# EAGLE design msp430 (EAGLE 7.1.0)
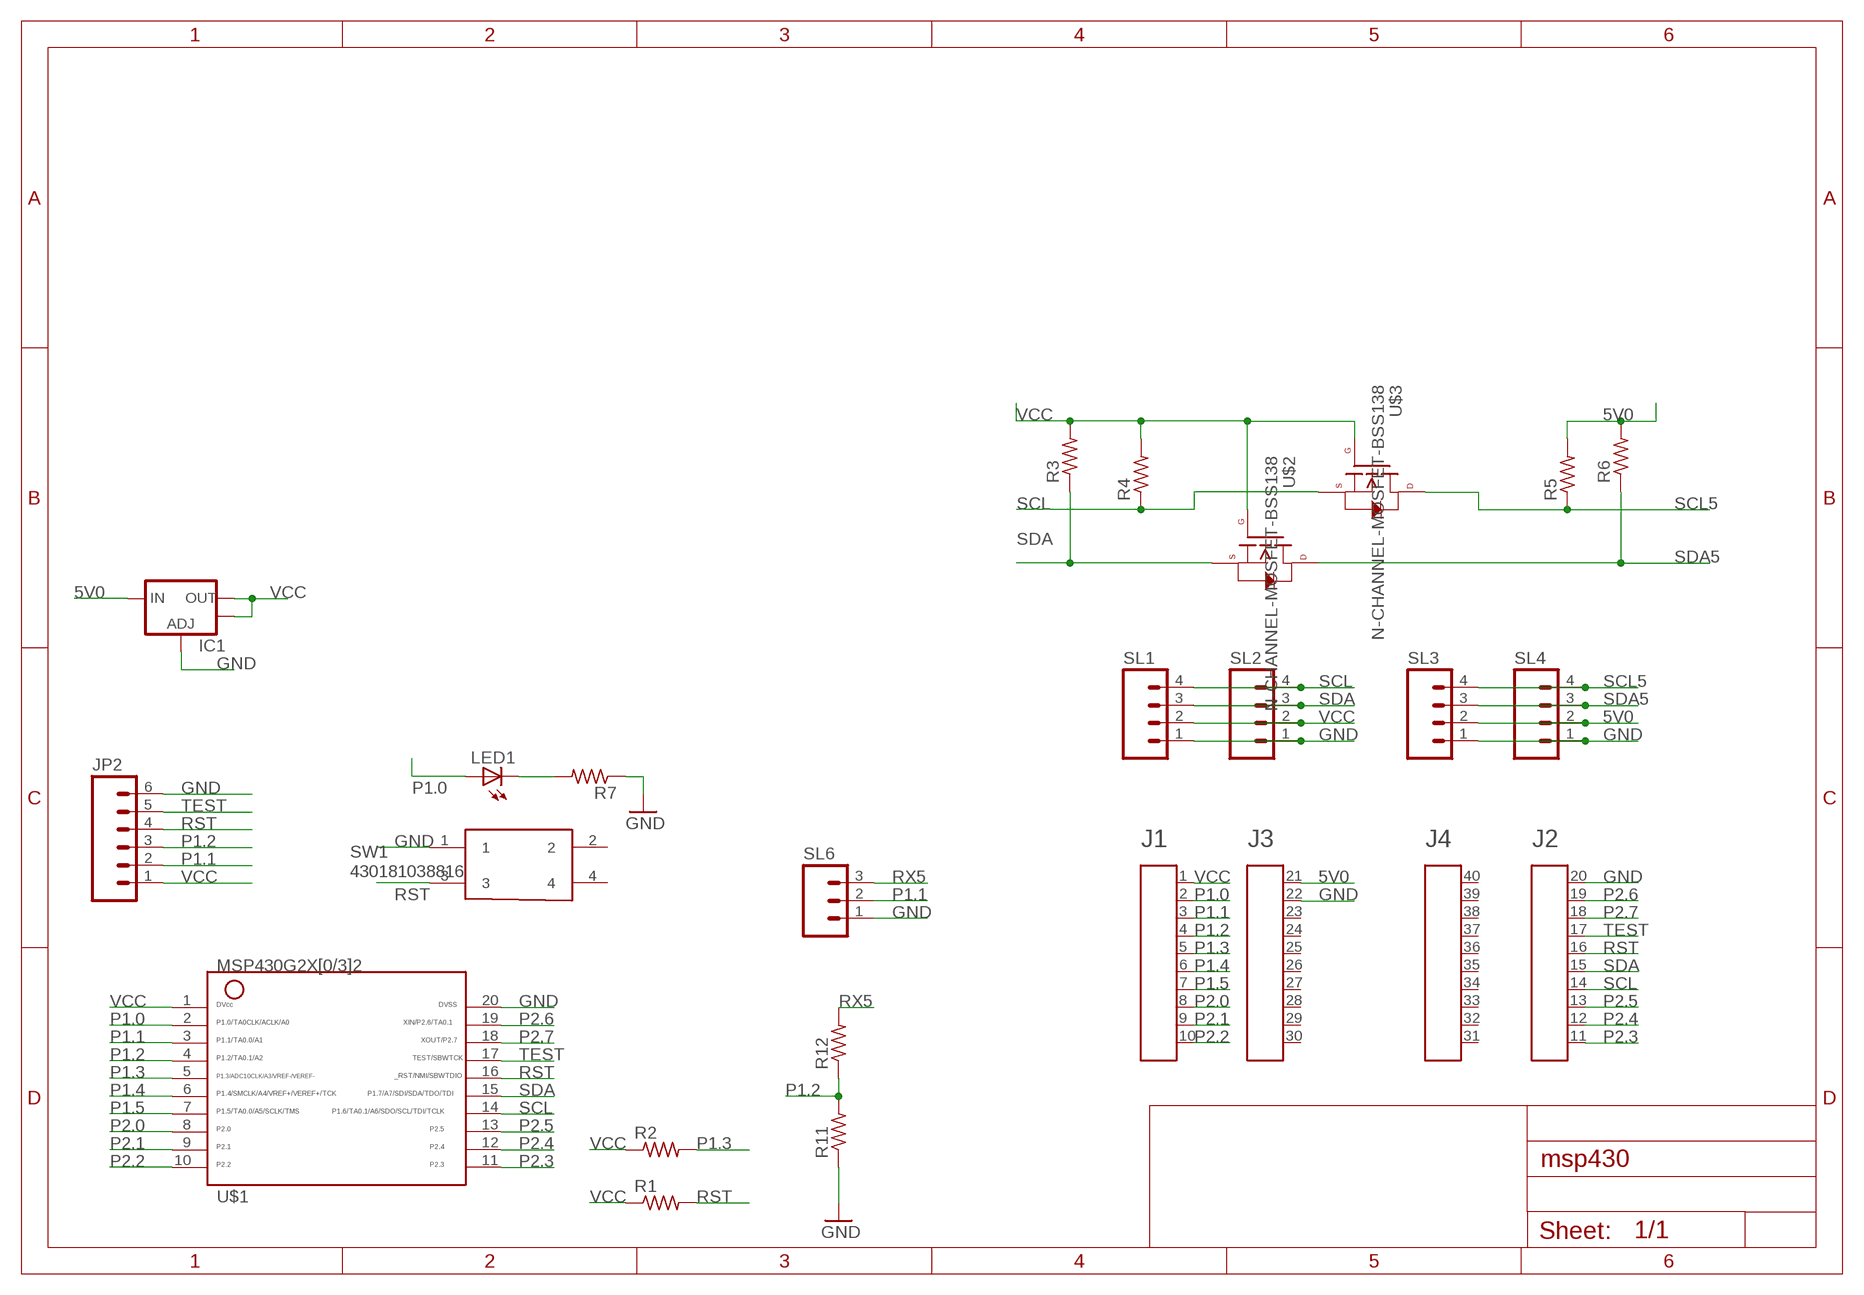
[diagram p0: schematic, sheet 1]

## Parts
A1  HEADER4X10-BOOSTERPACK  [4X10-BOOSTERPACK]
IC1  V_REG_LM1117SOT223  [SOT223]
JP2  M06LOCK  [1X06_LOCK]
LED1  LEDCHIPLED_0805  [CHIPLED_0805]
R1  R-US_M0805  [M0805]
R2  R-US_M0805  [M0805]
R3  R-US_M0805  [M0805]
R4  R-US_M0805  [M0805]
R5  R-US_M0805  [M0805]
R6  R-US_M0805  [M0805]
R7  R-US_M0805  [M0805]
R11  R-US_M0805  [M0805]
R12  R-US_M0805  [M0805]
SL1  M04  [04P]
SL2  M04  [04P]
SL3  M04  [04P]
SL4  M04  [04P]
SL6  M03  [03P]
SW1  430181038816  [430181038816]
U$1  G2X[0/3]2---N20  [N20]
U$2  N-CHANNEL-MOSFET-BSS138  [SOT23-3]
U$3  N-CHANNEL-MOSFET-BSS138  [SOT23-3]

## Nets
5V0: A1.21 IC1.3(IN) R5.2 R6.2 SL3.2 SL4.2
GND: A1.20 A1.22 IC1.1(ADJ) JP2.6 R7.1 R11.1 SL1.1 SL2.1 SL3.1 SL4.1 SL6.1 SW1.1 U$1.20
N$1: LED1.C R7.2
P1.0: A1.2 LED1.A U$1.2
P1.1: A1.3 JP2.2 SL6.2 U$1.3
P1.2: A1.4 JP2.3 R11.2 R12.1 U$1.4
P1.3: A1.5 R2.2 U$1.5
P1.4: A1.6 U$1.6
P1.5: A1.7 U$1.7
P2.0: A1.8 U$1.8
P2.1: A1.9 U$1.9
P2.2: A1.10 U$1.10
P2.3: A1.11 U$1.11
P2.4: A1.12 U$1.12
P2.5: A1.13 U$1.13
P2.6: A1.19 U$1.19
P2.7: A1.18 U$1.18
RST: A1.16 JP2.4 R1.2 SW1.3 U$1.16
RX5: R12.2 SL6.3
SCL: A1.14 R4.1 SL1.4 SL2.4 U$1.14 U$3.2(S)
SCL5: R5.1 SL3.4 SL4.4 U$3.3(D)
SDA: A1.15 R3.1 SL1.3 SL2.3 U$1.15 U$2.2(S)
SDA5: R6.1 SL3.3 SL4.3 U$2.3(D)
TEST: A1.17 JP2.5 U$1.17
VCC: A1.1 IC1.2(OUT) IC1.4(OUT) JP2.1 R1.1 R2.1 R3.2 R4.2 SL1.2 SL2.2 U$1.1 U$2.1(G) U$3.1(G)
Unconnected: A1.23 A1.24 A1.25 A1.26 A1.27 A1.28 A1.29 A1.30 A1.31 A1.32 A1.33 A1.34 A1.35 A1.36 A1.37 A1.38 A1.39 A1.40 SW1.2 SW1.4

## Library data of the parts
A1 = EAGLE_BoosterPack_Library:HEADER4X10-BOOSTERPACK
IC1 = tpdl-regulators:V_REG_LM1117: Voltage Regulator LM1117 Standard adjustable voltage regulator but in SMD form. Spark Fun Electronics SKU : COM-00595
JP2 = thoughtprocess:M06: Header 6 Standard 6-pin 0.1" header. Use with straight break away headers (SKU : PRT-00116), right angle break away headers (PRT-00553), swiss pins (PRT-00743), machine pins (PRT-00117), and female headers (PRT-00115). Molex polarized connector foot print use with SKU : PRT-08094 with associated crimp pins and housings. NOTES ON THE VARIANTS LOCK and LOCK_LONGPADS... This footprint was designed to help hold the alignment of a through-hole component (i.e. 6-pin header) while soldering it into place. You may notice that each hole has been shifted either up or down by 0.005 of an inch from it's more standard position (which is a perfectly straight line). This slight alteration caused the pins (the squares in the middle) to touch the edges of the holes. Because they are alternating, it causes a "brace" to hold the component in place. 0.005 has proven to be the perfect amount of "off-center" position when using our standard breakaway headers. Although looks a little odd when you look at the bare footprint, once you have a header in there, the alteration is very hard to notice. Also,if you push a header all the way into place, it is covered up entirely on the bottom side. This idea of altering the position of holes to aid alignment will be further integrated into the Sparkfun Library for other footprints. It can help hold any component with 3 or more connection pins.
LED1 = adafruit:LED: LED OSRAM: - CHIPLED LG R971, LG N971, LY N971, LG Q971, LY Q971, LO R971, LY R971 LH N974, LH R974 LS Q976, LO Q976, LY Q976 LO Q996 - Hyper CHIPLED LW Q18S LB Q993, LB Q99A, LB R99A - SideLED LS A670, LO A670, LY A670, LG A670, LP A670 LB A673, LV A673, LT A673, LW A673 LH A674 LY A675 LS A676, LA A676, LO A676, LY A676, LW A676 LS A679, LY A679, LG A679 - Hyper Micro SIDELED® LS Y876, LA Y876, LO Y876, LY Y876 LT Y87S - SmartLED LW L88C, LW L88S LB L89C, LB L89S, LG L890 LS L89K, LO L89K, LY L89K LS L896, LA L896, LO L896, LY L896 - TOPLED LS T670, LO T670, LY T670, LG T670, LP T670 LSG T670, LSP T670, LSY T670, LOP T670, LYG T670 LG T671, LOG T671, LSG T671 LB T673, LV T673, LT T673, LW T673 LH T674 LS T676, LA T676, LO T676, LY T676, LB T676, LH T676, LSB T676, LW T676 LB T67C, LV T67C, LT T67C, LS T67K, LO T67K, LY T67K, LW E67C LS E67B, LA E67B, LO E67B, LY E67B, LB E67C, LV E67C, LT E67C LW T67C LS T679, LY T679, LG T679 LS T770, LO T770, LY T770, LG T770, LP T770 LB T773, LV T773, LT T773, LW T773 LH T774 LS E675, LA E675, LY E675, LS T675 LS T776, LA T776, LO T776, LY T776, LB T776 LHGB T686 LT T68C, LB T68C - Hyper Mini TOPLED® LB M676 - Mini TOPLED Santana® LG M470 LS M47K, LO M47K, LY M47K Source: http://www.osram.convergy.de/
R1-R7 R11 R12 = tpdl-passives:R-US_: RESISTOR, American symbol
SL1-SL4 = con-amp-quick:M04: AMP QUICK CONNECTOR; OC_FARNELL: unknown; OC_NEWARK: unknown
SL6 = con-amp-quick:M03: AMP QUICK CONNECTOR; OC_FARNELL: unknown; OC_NEWARK: unknown
SW1 = tpdl-switches:430181038816: WS-TSS-4.5x4.5 mm SMD Tact Switch,4 pins
U$1 = TI_MSP430_v16:G2X[0/3]2---N20: MSP430G2X[0/3]2 MSP430G2x32, MSP430G2x02 PDIP (N) 20 Pin Package http://focus.ti.com/docs/prod/folders/print/msp430g2432.html
U$2 U$3 = tpdl-actives:N-CHANNEL-MOSFET: N-Channel MOSFET Mode Field Effect Transistor; DATASHEET: http://www.fairchildsemi.com/ds/BS/BSS138.pdf; DIGIKEY: BSS138TR-ND; ELEMENT14: 2323154; URL: http://au.element14.com/fairchild-semiconductor/bss138/mosfet-n-ch-50v-220ma-sot-23/dp/2323154

## Board
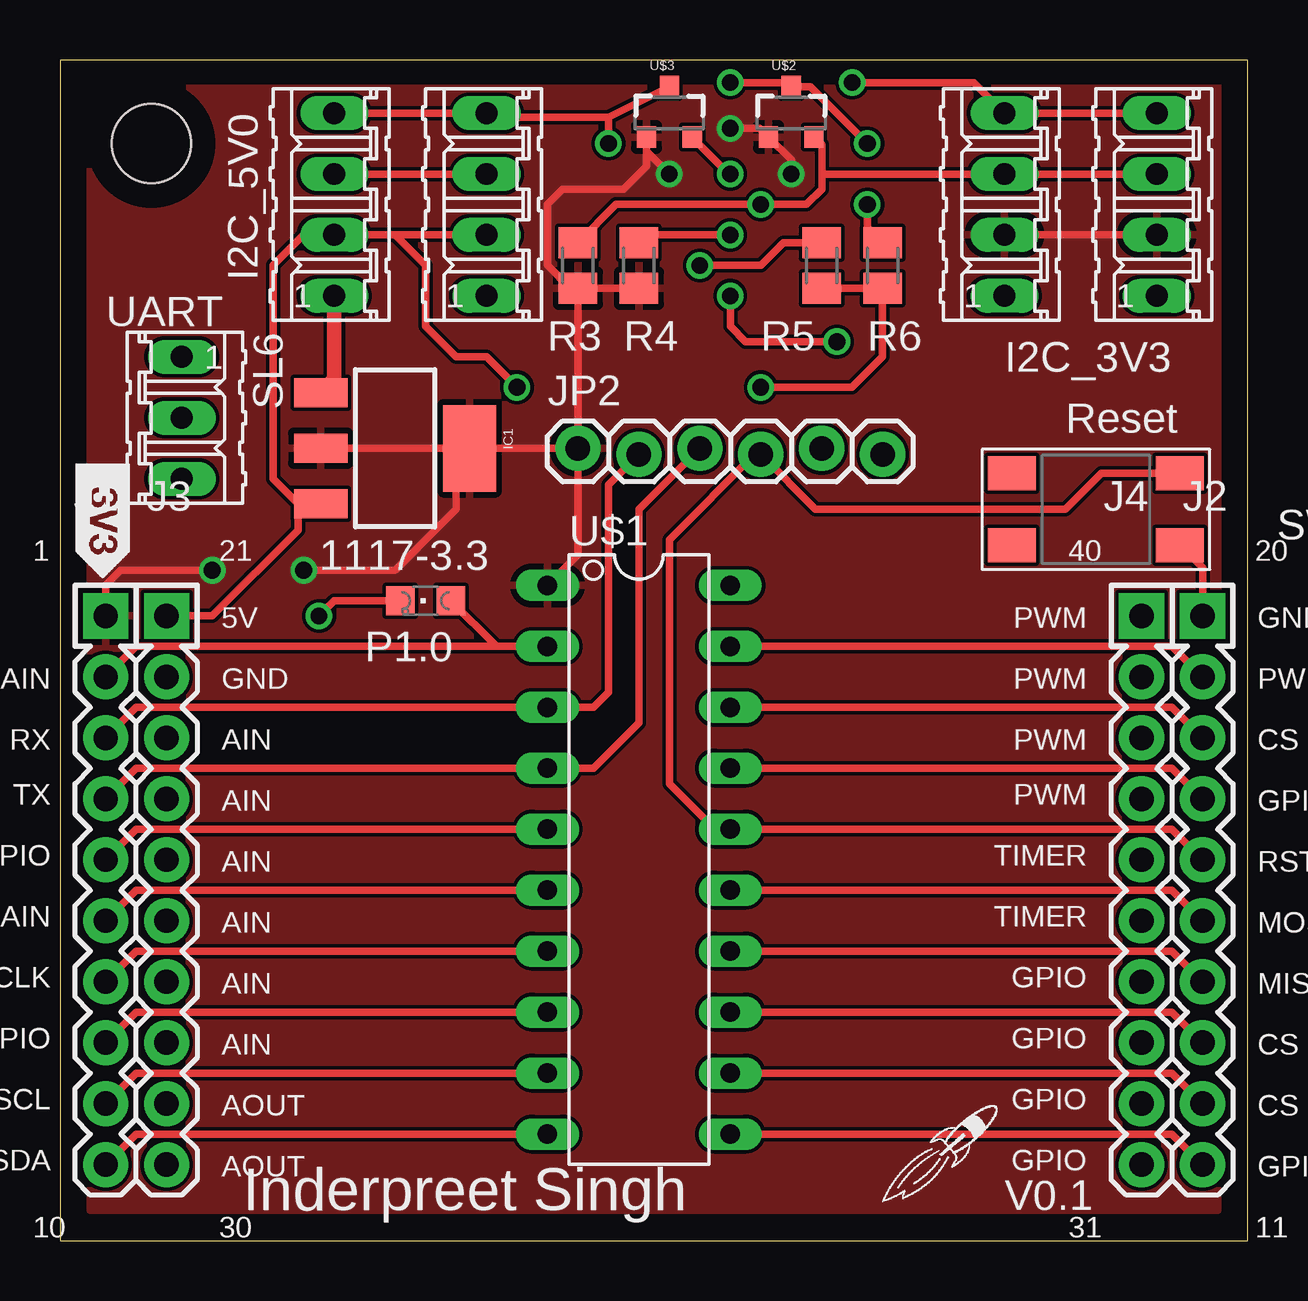
[diagram p1: board, top side]
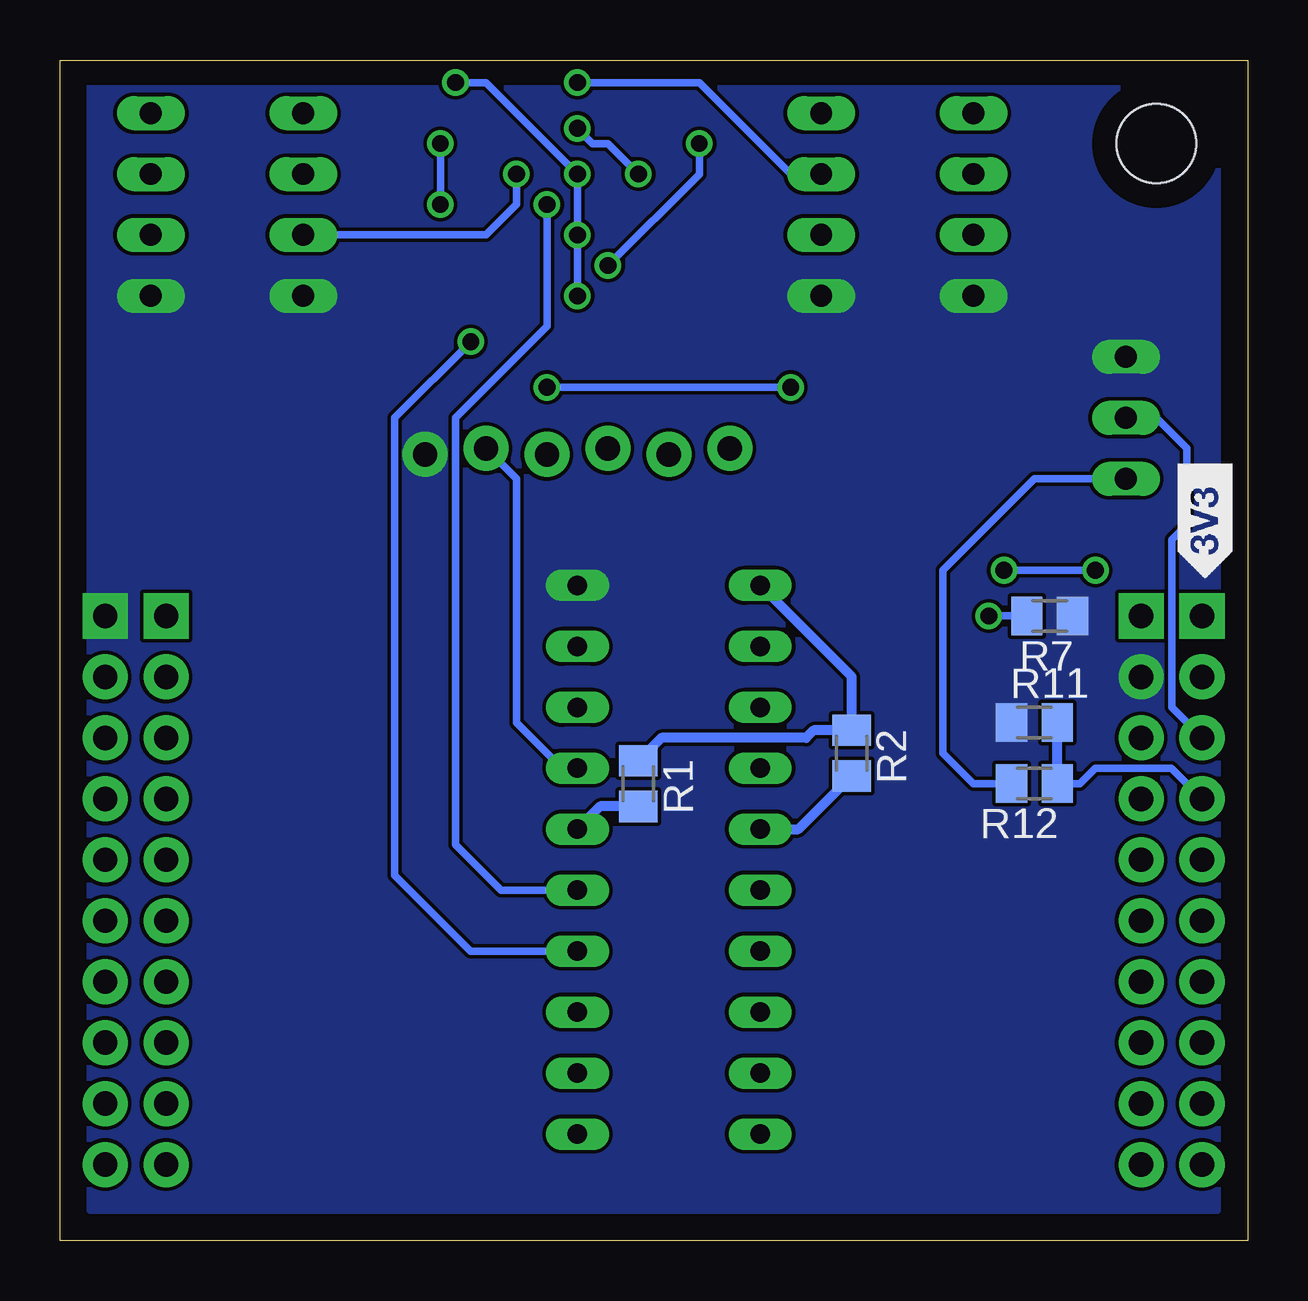
[diagram p2: board, bottom side, seen from below]

Size 49.51 x 49.2 mm. Coordinates in mm from the lower left corner, seen from the top.
Outline: 0,0 49.51,0 49.51,49.2 0,49.2 0,0
Copper layers (1*16): Top 0.035mm / dielectric 1.5mm / Bottom 0.035mm
Design rules "default *": minimum track width 10mil, minimum drill 24mil, track to track 6mil, track to pad 6mil, pad to pad 6mil, via to via 6mil, smd to smd 6mil, copper to edge 40mil, drill to drill 8mil, minimum pad ring 10mil, minimum via ring 8mil, stop-mask expansion 4mil, vias tented up to drill 0mil, thermal gap 10mil

### Footprints (pad centres in the part's own frame; a part is rotated, then mirrored left to right if it is on the bottom)
4X10-BOOSTERPACK = drill 1.016 pad 1.88 square: 1 0,10.16; 20 45.72,10.16; 21 2.54,10.16; 40 43.18,10.16 | drill 1.016 pad 1.88: 2 0,7.62; 3 0,5.08; 4 0,2.54; 5 0,0; 6 0,-2.54; 7 0,-5.08; 8 0,-7.62; 9 0,-10.16; 10 0,-12.7; 11 45.72,-12.7; 12 45.72,-10.16; 13 45.72,-7.62; 14 45.72,-5.08; 15 45.72,-2.54; 16 45.72,0; 17 45.72,2.54; 18 45.72,5.08; 19 45.72,7.62; 22 2.54,7.62; 23 2.54,5.08; 24 2.54,2.54; 25 2.54,0; 26 2.54,-2.54; 27 2.54,-5.08; 28 2.54,-7.62; 29 2.54,-10.16; 30 2.54,-12.7; 31 43.18,-12.7; 32 43.18,-10.16; 33 43.18,-7.62; 34 43.18,-5.08; 35 43.18,-2.54; 36 43.18,0; 37 43.18,2.54; 38 43.18,5.08; 39 43.18,7.62
SOT223 = smd 1.219 x 2.235: 1 -2.311,-3.099; 2 0,-3.099; 3 2.311,-3.099 | smd 3.6 x 2.2: 4 0,3.099
1X06_LOCK = drill 1.016 pad 1.88: 1 0,0; 2 2.54,-0.254; 3 5.08,0; 4 7.62,-0.254; 5 10.16,0; 6 12.7,-0.254
CHIPLED_0805 = smd 1.2 x 1.2: A 0,-1.05; C 0,1.05
M0805 = smd 1.3 x 1.6: 1 -0.95,0; 2 0.95,0
04P = drill 0.914 long: 1 -3.81,0; 2 -1.27,0; 3 1.27,0; 4 3.81,0
03P = drill 0.914 long: 1 -2.54,0; 2 0,0; 3 2.54,0
430181038816 = smd 2 x 1.4: 1 -3.5,1.5; 2 3.5,1.5; 3 -3.5,-1.5; 4 3.5,-1.5
N20 = drill 0.813 long: 1 -11.435,-3.81; 2 -8.895,-3.81; 3 -6.355,-3.81; 4 -3.815,-3.81; 5 -1.275,-3.81; 6 1.265,-3.81; 7 3.805,-3.81; 8 6.345,-3.81; 9 8.885,-3.81; 10 11.425,-3.81; 11 11.425,3.81; 12 8.885,3.81; 13 6.345,3.81; 14 3.805,3.81; 15 1.265,3.81; 16 -1.275,3.81; 17 -3.815,3.81; 18 -6.355,3.81; 19 -8.895,3.81; 20 -11.435,3.81
SOT23-3 = smd 0.8 x 0.9: 1 -0.95,-1; 2 0.95,-1; 3 0,1.1
STAND-OFF = hole 3.302: 0,0

### Placement (x,y rotation side)
A1  1.91,15.88 0 top
IC1  13.97,33.02 270 top
JP2  21.59,33.02 0 top
LED1  15.24,26.67 90 top
R1  25.4,19.05 270 bottom
R2  16.51,20.32 270 bottom
R3  21.59,40.64 270 top
R4  24.13,40.64 270 top
R5  31.75,40.64 270 top
R6  34.29,40.64 270 top
R7  8.26,26.04 180 bottom
R11  8.89,21.59 0 bottom
R12  8.89,19.05 180 bottom
SL1  39.37,43.18 90 top
SL2  45.72,43.18 90 top
SL3  17.78,43.18 90 top
SL4  11.43,43.18 90 top
SL6  5.08,34.29 270 top
SW1  43.18,30.48 180 top
U$1  24.13,15.88 270 top
U$2  30.48,46.99 0 top
U$3  25.4,46.99 0 top
U$4  [STAND-OFF]  3.81,45.72 0 top
U$5  [SILK_3V3_TAG]  0.64,32.38 270 top
U$6  [LOGO-ROCKET]  36.83,3.81 0 top

### Tracks (layer width: path | path; a pad name or v marks a point on that pad's centre or on a via)
5V0  (via drill 0.7)
  Top 0.305: 13.97,41.91 SL4.2 10.16,41.91 8.89,40.64 8.89,31.75 9.93,30.71 | 13.97,41.91 SL3.2 | IC1.3 9.93,30.71 | 9.93,30.71 9.93,29.62 6.35,26.04 A1.21 | R5.2 R6.2 34.29,36.83 33.02,35.56 v29.21,35.56 | v19.05,35.56 17.78,36.83 16.51,36.83 15.24,38.1 15.24,40.64 13.97,41.91
  Bottom 0.305: v19.05,35.56 v29.21,35.56
GND
  Top 0.305: A1.20 47.62,28.04 SW1.1
  Top 0.61: SL4.1 11.43,35.89 IC1.1
  pour Bottom (no thermals): 1.27,48.26 48.26,48.26 48.26,1.27 1.27,1.27 1.27,46.99
N$1  (via drill 0.7)
  Top 0.305: LED1.C 11.43,26.67 v10.79,26.04
  Bottom 0.305: v10.79,26.04 R7.2
P1.0
  Top 0.305: A1.2 3.18,24.77 U$1.2 18.19,24.77 LED1.A
P1.1
  Top 0.305: A1.3 3.18,22.23 U$1.3 22.23,22.23 22.86,22.86 22.86,31.5 JP2.2
  Bottom 0.305: SL6.2 3.81,34.29 2.54,33.02 2.54,29.84 3.17,29.21 3.17,22.23 A1.3
P1.2
  Top 0.305: A1.4 3.18,19.69 U$1.4 22.23,19.69 24.13,21.59 24.13,30.48 JP2.3
  Bottom 0.305: R12.1 6.99,19.05 6.35,19.69 3.18,19.69 A1.4
  Bottom 0.406: R12.1 R11.2
P1.3
  Top 0.305: U$1.5 3.18,17.15 A1.5
  Bottom 0.406: U$1.5 18.73,17.15 R2.2
P1.4
  Top 0.305: U$1.6 3.18,14.61 A1.6
P1.5
  Top 0.305: U$1.7 3.18,12.07 A1.7
P2.0
  Top 0.305: U$1.8 3.18,9.53 A1.8
P2.1
  Top 0.305: U$1.9 3.18,6.99 A1.9
P2.2
  Top 0.305: U$1.10 3.18,4.45 A1.10
P2.3
  Top 0.305: U$1.11 46.35,4.45 A1.11
P2.4
  Top 0.305: U$1.12 46.35,6.99 A1.12
P2.5
  Top 0.305: U$1.13 46.35,9.53 A1.13
P2.6
  Top 0.305: U$1.19 46.35,24.77 A1.19
P2.7
  Top 0.305: U$1.18 46.35,22.23 A1.18
RST
  Top 0.305: A1.16 46.35,17.15 U$1.16 27.3,17.15 25.4,19.05 25.4,29.21 28.96,32.77 JP2.4 31.5,30.48 41.91,30.48 43.41,31.98 SW1.3
  Bottom 0.406: R1.2 26.99,18.1 U$1.16
RX5
  Bottom 0.305: R12.2 11.43,19.05 12.7,20.32 12.7,27.94 8.89,31.75 SL6.3
SCL  (via drill 0.7)
  Top 0.305: U$1.14 46.35,12.07 A1.14 | SL2.4 SL1.4 38.1,48.26 v33.02,48.26 | v27.94,41.91 24.45,41.91 R4.1 | v32.38,37.47 28.57,37.47 27.94,38.1 v27.94,39.37 | v27.94,44.45 27.89,44.45 U$3.2
  Bottom 0.305: U$1.14 32.39,12.07 35.56,15.24 35.56,34.29 v32.38,37.47 | v27.94,39.37 v27.94,41.91 v27.94,44.45 31.75,48.26 v33.02,48.26
SCL5  (via drill 0.7)
  Top 0.305: SL4.4 SL3.4 17.95,46.82 22.86,46.82 | 22.86,46.82 U$3.3 | R5.1 30.16,41.59 29.21,40.64 v26.67,40.64 | 22.86,46.82 v22.86,45.72
  Bottom 0.305: v22.86,45.72 22.86,44.45 v26.67,40.64
SDA  (via drill 0.7)
  Top 0.305: U$1.15 46.35,14.61 A1.15 | SL2.3 SL1.3 31.75,44.45 | R3.1 23.18,43.18 v29.21,43.18 31.11,43.18 31.75,43.81 31.75,44.45 | 31.75,44.45 31.75,45.67 U$2.2
  Bottom 0.305: U$1.15 31.12,14.61 33.02,16.51 33.02,34.29 29.21,38.1 v29.21,43.18
SDA5  (via drill 0.7)
  Top 0.305: SL3.3 SL4.3 | v33.66,45.72 31.29,48.09 U$2.3 30.31,48.26 v27.94,48.26 | v33.66,43.18 33.66,42.23 R6.1
  Bottom 0.305: v33.66,45.72 v33.66,43.18 | SL3.3 19.05,44.45 22.86,48.26 v27.94,48.26
TEST
  Top 0.305: U$1.17 46.35,19.69 A1.17
  Bottom 0.305: U$1.17 28.58,19.69 30.48,21.59 30.48,31.75 JP2.5
VCC  (via drill 0.7)
  Top 0.305: JP2.1 21.59,28.58 U$1.1 | SL1.2 SL2.2 | JP2.1 IC1.4 16.51,33.02 | 16.51,33.02 IC1.2 | v10.16,27.94 13.97,27.94 16.51,30.48 16.51,33.02 | v6.35,27.94 2.54,27.94 1.91,27.3 A1.1 | R4.2 R3.2 | R3.2 21.27,39.69 20.32,40.64 20.32,43.18 20.95,43.81 23.5,43.81 24.45,44.77 U$3.1 24.45,45.4 v25.4,44.45 | R3.2 JP2.1 | v30.48,44.45 30.48,45.04 U$2.1 29.16,46.35 v27.94,46.35
  Bottom 0.305: v10.16,27.94 v6.35,27.94 | v25.4,44.45 26.67,45.72 27.3,45.72 v27.94,46.35 | SL1.2 31.75,41.91 30.48,43.18 v30.48,44.45
  Bottom 0.406: R1.1 24.45,20.95 18.41,20.95 18.1,21.27 R2.1 16.51,23.5 U$1.1
  pour Top: 1.27,48.26 48.26,48.26 48.26,1.27 1.27,1.27

### Text on the board
tNames: I2C_5V0 | UART | I2C_3V3 | Reset | 1117-3.3 | P1.0 | Inderpreet Singh | V0.1